# Altium schematic sheet Schematic_ASTRA_UNIT00_2024-12-20.schdoc
size 226 x 156 mm
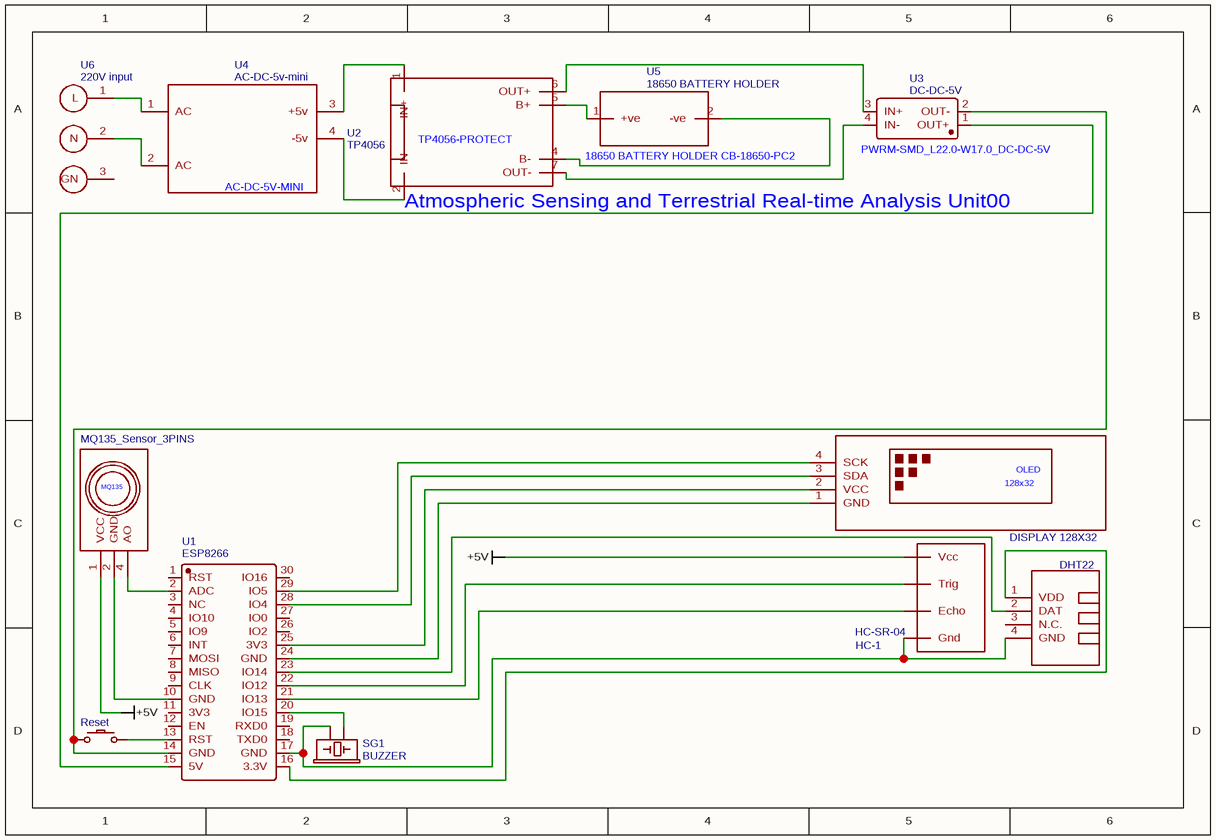
[diagram p0: Schematic_ASTRA_UNIT00_2024-12-20.schdoc]

## Parts
1  DISPLAY 128X32  [DISPLAY-OLED-128X32]
2  DHT22  [TEMP-HUM-SENSOR-DHT22]
3  Reset  [32TEETH---CONDUCTIVE-BUTTONS_CONDUCTIVE_BUTTON_DIRECTIONAL_THICK]
HC-1  HC-SR-04  [HC-04]
SG1  BUZZER  [BUZZER-12MM-KIT]
U1  ESP8266  [WIFIM-TH_NODEMCU-8266]
U2  TP4056  [TP4056-PROTECT]
U3  DC-DC-5V  [PWRM-SMD_L22.0-W17.0_DC-DC-5V]
U4  AC-DC-5v-mini  [AC-DC-5V-MINI]
U5  18650 BATTERY HOLDER  [18650 BATTERY HOLDER CB-18650-PC2]
U6  220V input  [220V INPUT]
U7  MQ135_Sensor_3PINS  [MQ135_MODULO]

## Nets
+5V: HC-1.VCC(Vcc) U7.1(VCC)
Net1_1: 1.1(GND) U1.24(GND)
Net1_2: 1.2(VCC) U1.25(3V3)
Net1_3: 1.3(SDA) U1.28(IO4)
Net1_4: 1.4(SCK) U1.29(IO5)
Net2_1: 2.1(VDD) U1.16(3.3V)
Net2_2: 2.2(DAT) U1.23(IO14)
Net2_4: 2.4(GND) HC-1.GND(Gnd) SG1.- U1.17(GND)
Net3_P$ACTIVE: 3.P$ACTIVE U1.13(RST)
Net3_P$GND: 3.P$GND U1.14(GND) U3.2(OUT-)
NetHC-1_ECHO: HC-1.ECHO(Echo) U1.21(IO13)
NetHC-1_TRIG: HC-1.TRIG(Trig) U1.22(IO12)
NetSG1_+: SG1.+ U1.20(IO15)
NetU1_2: U1.2(ADC) U7.4(AO)
NetU1_10: U1.10(GND) U7.2(GND)
NetU1_15: U1.15(5V) U3.1(OUT+)
NetU2_1: U2.1(IN+) U4.3(+5v)
NetU2_2: U2.2(IN-) U4.4(-5v)
NetU2_4: U2.4(B-) U5.2(-ve)
NetU2_5: U2.5(B+) U5.1(+ve)
NetU2_6: U2.6(OUT+) U3.3(IN+)
NetU2_7: U2.7(OUT-) U3.4(IN-)
NetU4_1: U4.1(AC) U6.1(L)
NetU4_2: U4.2(AC) U6.2(N)

Not connected (* = marked no-connect by the designer): 2 3(N.C.); U1 1(RST) 3(NC) 4(IO10) 5(IO9) 6(INT) 7(MOSI) 8(MISO) 9(CLK) 11(3V3) 12(EN) 18(TXD0) 19(RXD0) 26(IO2) 27(IO0) 30(IO16); U6 3(GN)

## Notes on the sheet
- (near U2) Atmospheric Sensing and Terrestrial Real-time Analysis Unit00
- (in symbol 18650 BATTERY HOLDER) 18650 BATTERY HOLDER CB-18650-PC2
- (in symbol AC-DC-5v-mini) AC-DC-5V-MINI
- (in symbol DC-DC-5V) PWRM-SMD_L22.0-W17.0_DC-DC-5V
- (in symbol DISPLAY 128X32) OLED; 128x32
- (in symbol MQ135_Sensor_3PINS) MQ135
- (in symbol TP4056) TP4056-PROTECT

## Library data of the parts
1 = DISPLAY 128X32: Contributor: Neeraj Aggarwal; Package Display: No; spicePre: ?; spiceSymbolName: DISPLAY-OLED-128X32
2 = DHT22: Contributor: Koushik1111; Package Display: No; spicePre: ?; spiceSymbolName: TEMP-HUM-SENSOR-DHT22
3 = Reset: Contributor: dipaolo.1882662; Package Display: No; spicePre: ?; spiceSymbolName: button
HC-1 = HC-SR-04: Contributor: Malov999; Package Display: No; spicePre: h; spiceSymbolName: HC-SR-04
SG1 = BUZZER: Contributor: Daniil-Shteud; Package Display: No; spicePre: S; spiceSymbolName: BUZZER
U1 = ESP8266: Manufacturer: Ai-Thinker(安信可); Manufacturer Part: NODEMCU(12F); Contributor: lcsc; Package Display: No; Supplier: LCSC; Supplier Part: C2764098; JLCPCB Part Class: Extended Part; spicePre: U; spiceSymbolName: NODEMCU(12F)
U2 = TP4056: Contributor: James Martin; Package Display: Yes; Manufacturer Part: TP4056-protect; link: https://dlnmh9ip6v2uc.cloudfront.net/datasheets/Prototyping/TP4056.pdf; spicePre: U; spiceSymbolName: TP4056
U3 = DC-DC-5V: Manufacturer: null; Contributor: LCSC; Package Display: Yes; Supplier: LCSC; Supplier Part: C9900001346; Manufacturer Part: DC-DC-5V; JLCPCB Part Class: Extended Part; spicePre: U; spiceSymbolName: DC-DC-5V
U4 = AC-DC-5v-mini: Contributor: Prim_2006; Package Display: Yes; Supplier Part: AC-DC-5v-mini; spicePre: U; spiceSymbolName: AC-DC-5v-mini
U5 = 18650 BATTERY HOLDER: Contributor: wjya _rcr; Package Display: Yes; spicePre: U; spiceSymbolName: 18650 BATTERY HOLDER CB-18650-PC2 _NOTEMP COPY
U6 = 220V input: Contributor: paulenaz690; Package Display: No; spicePre: U; spiceSymbolName: 220V input
U7 = MQ135_Sensor_3PINS: Contributor: Frederico A; Package Display: No; spicePre: U; spiceSymbolName: MQ135_Sensor_3PINS